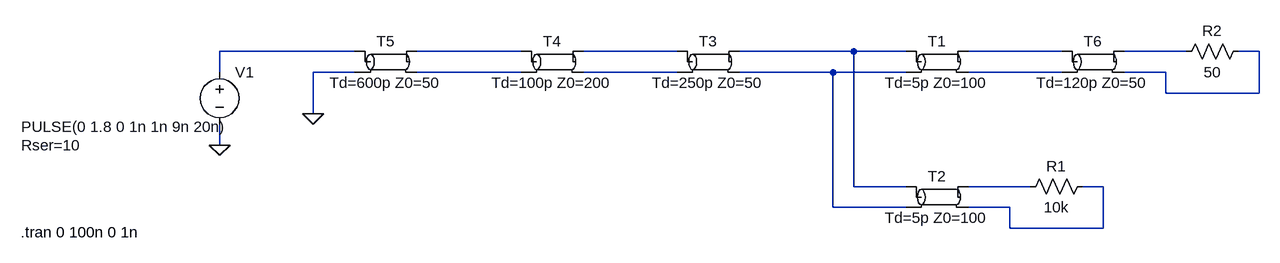
[diagram p0: schematic TL.asc]
TL.asc, the LTspice schematic file:
Version 4
SHEET 1 880 680
WIRE -800 128 -1008 128
WIRE -544 128 -704 128
WIRE -304 128 -448 128
WIRE -32 128 -208 128
WIRE 48 128 -32 128
WIRE 288 128 144 128
WIRE 480 128 384 128
WIRE 592 128 560 128
WIRE -1008 160 -1008 128
WIRE -800 160 -864 160
WIRE -544 160 -704 160
WIRE -304 160 -448 160
WIRE -64 160 -208 160
WIRE 48 160 -64 160
WIRE 288 160 144 160
WIRE 448 160 384 160
WIRE 448 192 448 160
WIRE 592 192 592 128
WIRE 592 192 448 192
WIRE -864 224 -864 160
WIRE -1008 272 -1008 240
WIRE -32 336 -32 128
WIRE 48 336 -32 336
WIRE 240 336 144 336
WIRE 352 336 320 336
WIRE -64 368 -64 160
WIRE 48 368 -64 368
WIRE 208 368 144 368
WIRE 208 400 208 368
WIRE 352 400 352 336
WIRE 352 400 208 400
FLAG -1008 272 0
FLAG -864 224 0
SYMBOL tline 96 144 R0
SYMATTR InstName T1
SYMATTR Value Td=5p Z0=100
SYMBOL tline 96 352 R0
SYMATTR InstName T2
SYMATTR Value Td=5p Z0=100
SYMBOL tline -256 144 R0
SYMATTR InstName T3
SYMATTR Value Td=250p Z0=50
SYMBOL tline -496 144 R0
SYMATTR InstName T4
SYMATTR Value Td=100p Z0=200
SYMBOL tline -752 144 R0
SYMATTR InstName T5
SYMATTR Value Td=600p Z0=50
SYMBOL voltage -1008 144 R0
WINDOW 3 -305 100 Left 2
WINDOW 123 0 0 Left 0
WINDOW 39 -305 128 Left 2
SYMATTR InstName V1
SYMATTR Value PULSE(0 1.8 0 1n 1n 9n 20n)
SYMATTR SpiceLine Rser=10
SYMBOL res 336 320 R90
WINDOW 0 0 56 VBottom 2
WINDOW 3 32 56 VTop 2
SYMATTR InstName R1
SYMATTR Value 10k
SYMBOL res 576 112 R90
WINDOW 0 0 56 VBottom 2
WINDOW 3 32 56 VTop 2
SYMATTR InstName R2
SYMATTR Value 50
SYMBOL tline 336 144 R0
SYMATTR InstName T6
SYMATTR Value Td=120p Z0=50
TEXT -1314 406 Left 2 !.tran 0 100n 0 1n

The netlist it stands for:
* TL.asc
T1 N004 N010 N005 N011 Td=5p Z0=100
T2 N004 N010 N012 N013 Td=5p Z0=100
T3 N003 N009 N004 N010 Td=250p Z0=50
T4 N002 N008 N003 N009 Td=100p Z0=200
T5 N001 0 N002 N008 Td=600p Z0=50
V1 N001 0 PULSE(0 1.8 0 1n 1n 9n 20n) Rser=10
R1 N013 N012 10k
R2 N007 N006 50
T6 N005 N011 N006 N007 Td=120p Z0=50
.tran 0 100n 0 1n
.backanno
.end